# EAGLE design untitled (EAGLE 9.6.2)
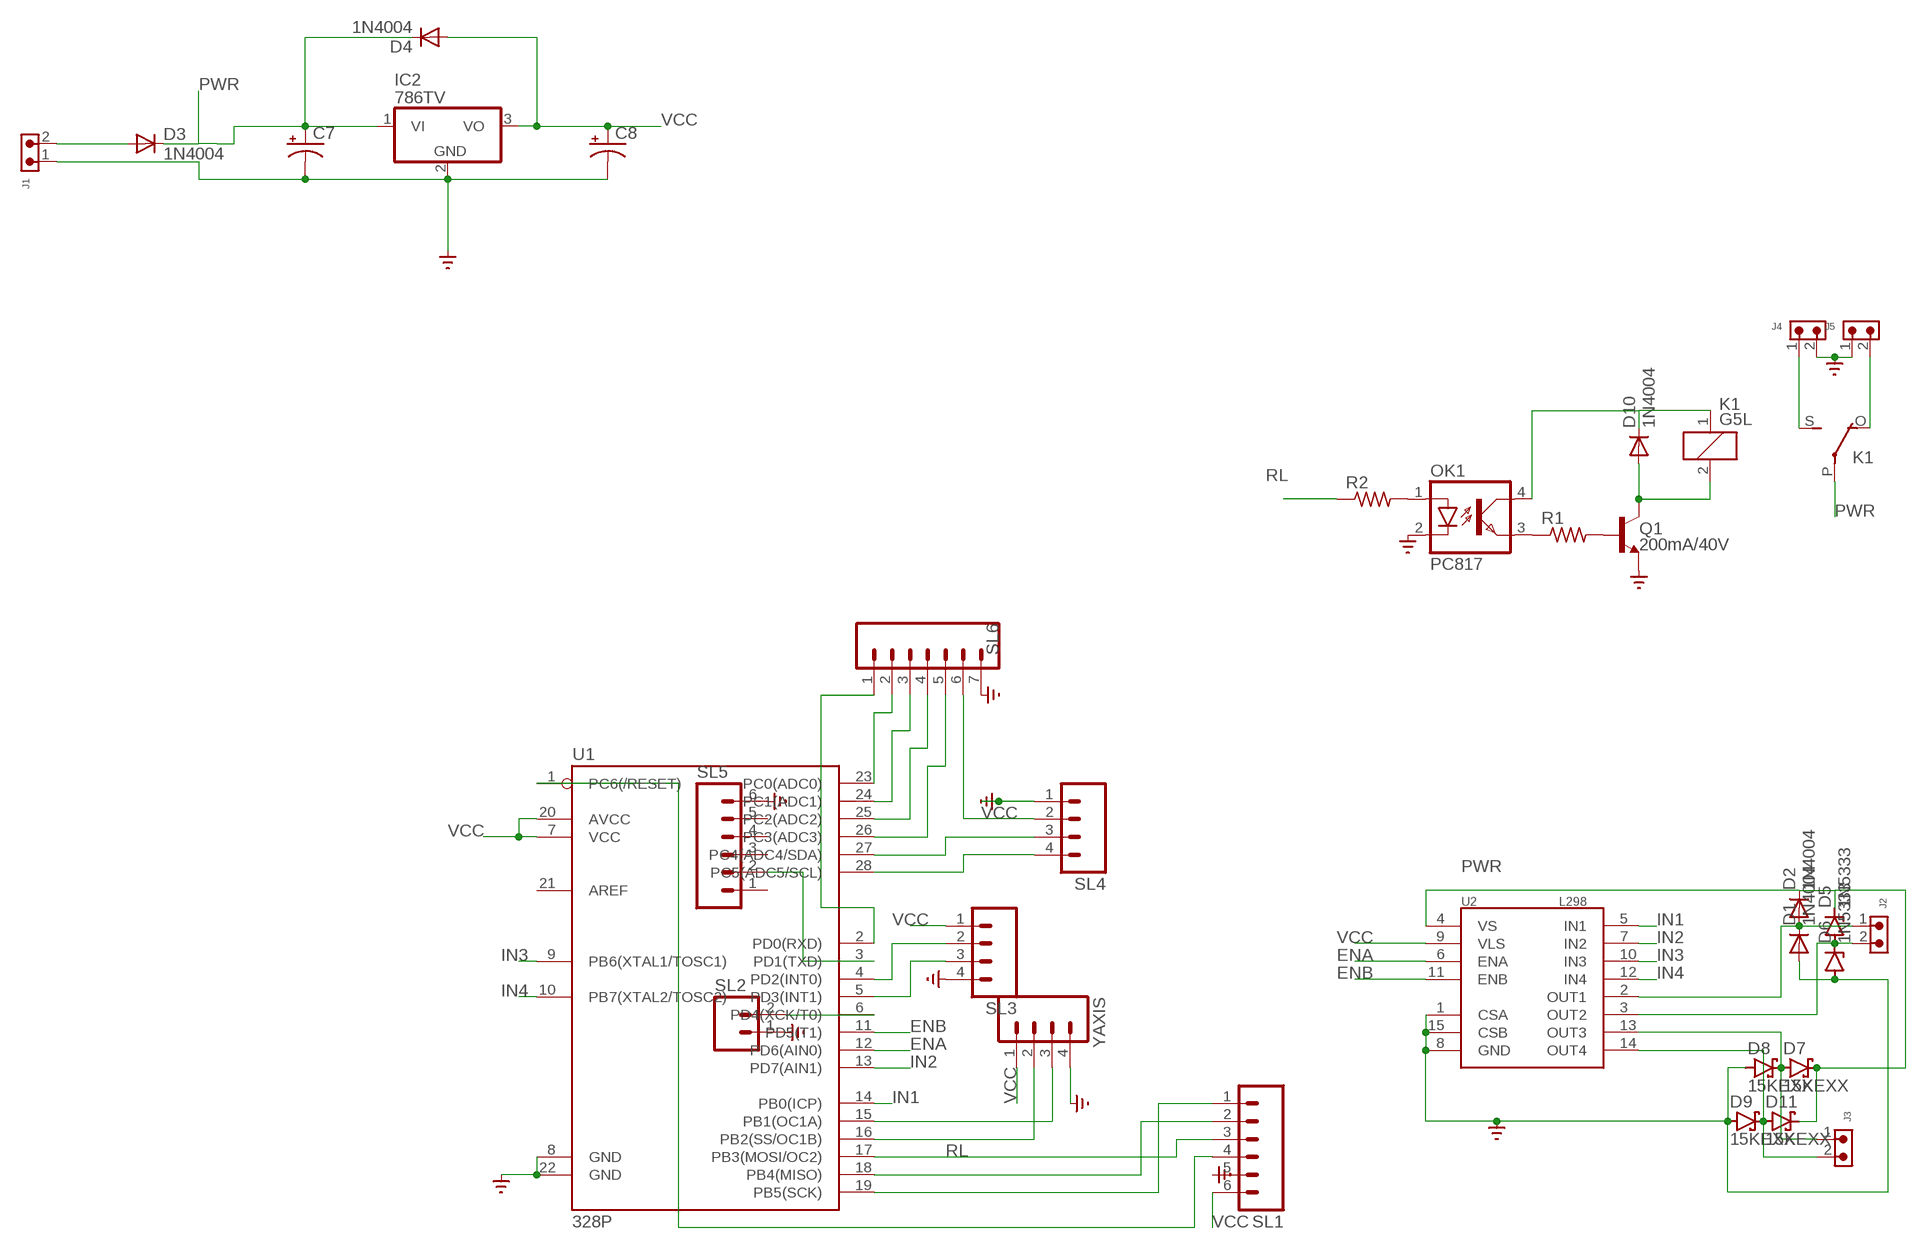
[diagram p0: schematic, sheet 1]

## Parts
C7  CAPACITOR-PE5-10.5  [E5-10,5]
C8  CAPACITOR-PE5-6  [E5-6]
D1  1N4004  [DO41-10]
D2  1N4004  [DO41-10]
D3  1N4004  [DO41-10]
D4  1N4004  [DO41-10]
D5  1N5333  [C1702-15]
D6  1N5333  [C1702-15]
D7  15KEXX  [CB429-17]
D8  15KEXX  [CB429-17]
D9  15KEXX  [CB429-17]
D10  1N4004  [DO41-10]
D11  15KEXX  [CB429-17]
IC2  786TV  [TO220V]
J1  691305530002  [691305530002]
J2  691305530002  [691305530002]
J3  691305530002  [691305530002]
J4  691305530002  [691305530002]
J5  691305530002  [691305530002]
K1  G5L  [G5LE]
OK1  PC817  [DIL04]
Q1  200mA/40V  TRANS_NPN-2N3904  [TO-92]
R1  R-US_0207/10  [0207/10]
R2  R-US_0207/10  [0207/10]
SL1  M06  [06P]
SL2  M02  [02P]
SL3  M04  [04P]
SL4  M04  [04P]
SL5  M06  [06P]
SL6  M07  [07P]
U1  328P  ATMEGA328P_PDIP  [DIP28]
U2  L298  [MULTIWATT15]
YAXIS  M04  [04P]

## Nets
ENA: U1.12(PD6(AIN0)) U2.6(ENA)
ENB: U1.11(PD5(T1)) U2.11(ENB)
GND: C7.- C8.- D1.A D6.A D8.A D9.A IC2.2(GND) J1.1 J4.2 J5.1 OK1.2(C) Q1.1(E) SL1.5 SL2.1 SL3.4 SL4.1 SL5.6 SL6.7 U1.8(GND) U1.22(GND) U2.1(CSA) U2.8(GND) U2.15(CSB) YAXIS.4 ; supply symbol labelled SUPPLY_BRASTAN_GND_
IN1: U1.14(PB0(ICP)) U2.5(IN1)
IN2: U1.13(PD7(AIN1)) U2.7(IN2)
IN3: U1.9(PB6(XTAL1/TOSC1)) U2.10(IN3)
IN4: U1.10(PB7(XTAL2/TOSC2)) U2.12(IN4)
N$1: SL6.2 U1.23(PC0(ADC0))
N$2: SL3.2 U1.4(PD2(INT0))
N$3: SL1.1 U1.19(PB5(SCK))
N$4: SL1.2 U1.18(PB4(MISO))
N$6: SL1.4 U1.1(PC6(/RESET))
N$7: D1.C D2.A J2.1 U2.2(OUT1)
N$8: D5.A D6.C J2.2 U2.3(OUT2)
N$9: D7.A D8.C J3.1 U2.13(OUT3)
N$10: D9.C D11.A J3.2 U2.14(OUT4)
N$11: U1.16(PB2(SS/OC1B)) YAXIS.2
N$12: U1.15(PB1(OC1A)) YAXIS.3
N$13: SL3.3 U1.5(PD3(INT1))
N$14: SL2.2 U1.6(PD4(XCK/T0))
N$15: SL5.2 U1.3(PD1(TXD))
N$16: SL6.1 U1.2(PD0(RXD))
N$17: SL4.3 U1.27(PC4(ADC4/SDA))
N$18: SL4.4 U1.28(PC5(ADC5/SCL))
N$19: SL6.3 U1.24(PC1(ADC1))
N$20: SL6.4 U1.25(PC2(ADC2))
N$21: SL6.5 U1.26(PC3(ADC3))
N$22: D10.C K1.1 OK1.4(COL)
N$23: J5.2 K1.O(2:O)
N$24: J4.1 K1.S(2:S)
N$25: D10.A K1.2 Q1.3(C)
N$26: Q1.2(B) R1.2
N$27: OK1.3(EMIT) R1.1
N$29: OK1.1(A) R2.2
PWR: C7.+ D2.C D3.A D3.C D4.C D5.C D7.C D11.C IC2.1(VI) J1.2 K1.P(2:P) U2.4(VS)
RL: R2.1 SL1.3 U1.17(PB3(MOSI/OC2))
VCC: C8.+ D4.A IC2.3(VO) SL1.6 SL3.1 SL4.2 SL6.6 U1.7(VCC) U1.20(AVCC) U2.9(VLS) YAXIS.1
Unconnected: SL5.1 SL5.3 SL5.4 SL5.5 U1.21(AREF)

## Library data of the parts
C7 C8 = BeagleBone_Blue_R3:CAPACITOR-P: POLARIZED CAPACITOR, American symbol
D1-D4 D10 = adafruit:1N4004: DIODE General purpose 1N400x type rectifier (With bigger pads) http://www.ladyada.net/library/pcb/eaglelibrary.html
D5 D6 = diode:1N5333: Z DIODE 3.3 V, 5W, 5 percent (Motorola)
D7-D9 D11 = diode:15KEXX: DIODE
IC2 = linear:78*: Positive VOLTAGE REGULATOR Source: http://cache.national.com/ds/LM/LM78L05.pdf http://www.fairchildsemi.com/ds/LM/LM7805.pdf
J1-J5 = Wurth_Connectors_WR-TBL Pluggable Connector:691305530002: WR-TBL Serie 3055 - 5,08 mm - PCB Header Vertical Entry with Plastic Latches KIND PROPERTIES Pitch 5.08 mm MATERIAL PROPERTIES Insulator Material PA66 Insulator Flammability Rating UL94 V-0 Insulator Color Green Terminal Material Copper Alloy Terminal Plating Tin-plated surface GENERAL INFORMATION Operating Temperature -40 up to +105 °C ELECTRICAL PROPERTIES IR UL 16 A Working Voltage [UL] 300 V (AC) Withstanding Voltage [UL] 2500 V (AC) Contact Resistance [UL] 20 mΩ CERTIFICATION UL Approval E315414 <https://www.we-online.com/catalog/media/o135349v209%20Family_WR-TBL3_6913055300xx.jpg> Details see: https://www.we-online.com/catalog/en/TBL_5_08_3055_6913055300XX/ Updated by Ella Wu 2019-12-30 2019(C) Wurth Elektronik; DATASHEET-URL: https://www.we-online.com/catalog/datasheet/691305530002.pdf; IR-UL: 16A; MOUNT: THT; PART-NUMBER: 691305530002; PINS: 2; PITCH: 5.08mm; TYPE: Vertical; WORKING-VOLTAGE-UL: 300V (AC)
K1 = relay:G5L: RELAY 1 x switch, 10 A/120 V AC, 8 A/30 V ADC, Omron; OC_FARNELL: unknown; OC_NEWARK: unknown
OK1 = optocoupler:PC817: SHARP OPTO COUPLER; MPN: PC817X4J000F; OC_FARNELL: 9707727; OC_NEWARK: 97K7059
Q1 = SparkFun-DiscreteSemi:TRANS_NPN: NPN transistor Current controlled devices typically used to amplify current or used as a switch. BC547 - COM-08928 <http://www.sparkfun.com/products/8928> (TO-92 45V 100mA) (1.Collector 2.Base 3.Emitter) 2N3904 - COM-00521 <http://www.sparkfun.com/products/521> (TO-92 40V 200mA) (1.Emitter 2.Base 3.Collector) P2N2222A - COM-12852 <http://www.sparkfun.com/products/12852> (TO-92 40V 600mA) (1.Collector 2.Base 3.Emitter); PROD_ID: TRANS-08447
R1 R2 = BeagleBone_Black_Wireless:R-US_: RESISTOR, American symbol
SL1 SL5 = con-amp-quick:M06: AMP QUICK CONNECTOR; OC_FARNELL: unknown; OC_NEWARK: unknown
SL2 = con-amp-quick:M02: AMP QUICK CONNECTOR; OC_FARNELL: unknown; OC_NEWARK: unknown
SL3 SL4 YAXIS = con-amp-quick:M04: AMP QUICK CONNECTOR; OC_FARNELL: unknown; OC_NEWARK: unknown
SL6 = con-amp-quick:M07: AMP QUICK CONNECTOR; OC_FARNELL: unknown; OC_NEWARK: unknown
U1 = SparkFun-IC-Microcontroller:ATMEGA328P_PDIP: Atmel 328P Through hole ATMEGA328P uC used in the Arduino 32kb flash, 1k EEPROM, 2k SRAM Datasheet <http://www.sparkfun.com/datasheets/Components/SMD/ATMega328.pdf> SparkFun Products Storefront component: AVR 28 Pin 20MHz 32K 6A/D - ATMega328P <https://www.sparkfun.com/products/9061> (COM-09061) SparkFun Simon Says - Through-Hole Soldering Kit <https://www.sparkfun.com/products/10547> (KIT-10547) SparkFun Learn to Solder - Simon Says <https://www.sparkfun.com/products/13708> (KIT-13708) SparkFun BigTime Watch Kit <https://www.sparkfun.com/products/11734> (KIT-11734) SparkFun ClockIt <https://www.sparkfun.com/products/10930> (KIT-10930) SparkFun Serial Enabled LCD Kit <https://www.sparkfun.com/products/10097> (LCD-10097) SparkFun Simon Tilts - Through Hole Soldering Kit <https://www.sparkfun.com/products/12634> (KIT-12634) SparkFun Frequency Counter Kit <https://www.sparkfun.com/products/10140> (KIT-10140) FabFM Radio Kit <https://www.sparkfun.com/products/11043> (KIT-11043) SparkFun Binary Blaster Kit <https://www.sparkfun.com/products/12037> (KIT-12037) SparkFun Metro-Gnome <https://www.sparkfun.com/products/9236> (KIT-09236) ATmega328 with Arduino Optiboot (Uno) <https://www.sparkfun.com/products/10524> (DEV-10524); PROD_ID: IC-09136
U2 = SparkFun-IC-Special-Function:L298: L298 Dual Full Bridge Driver

## Board
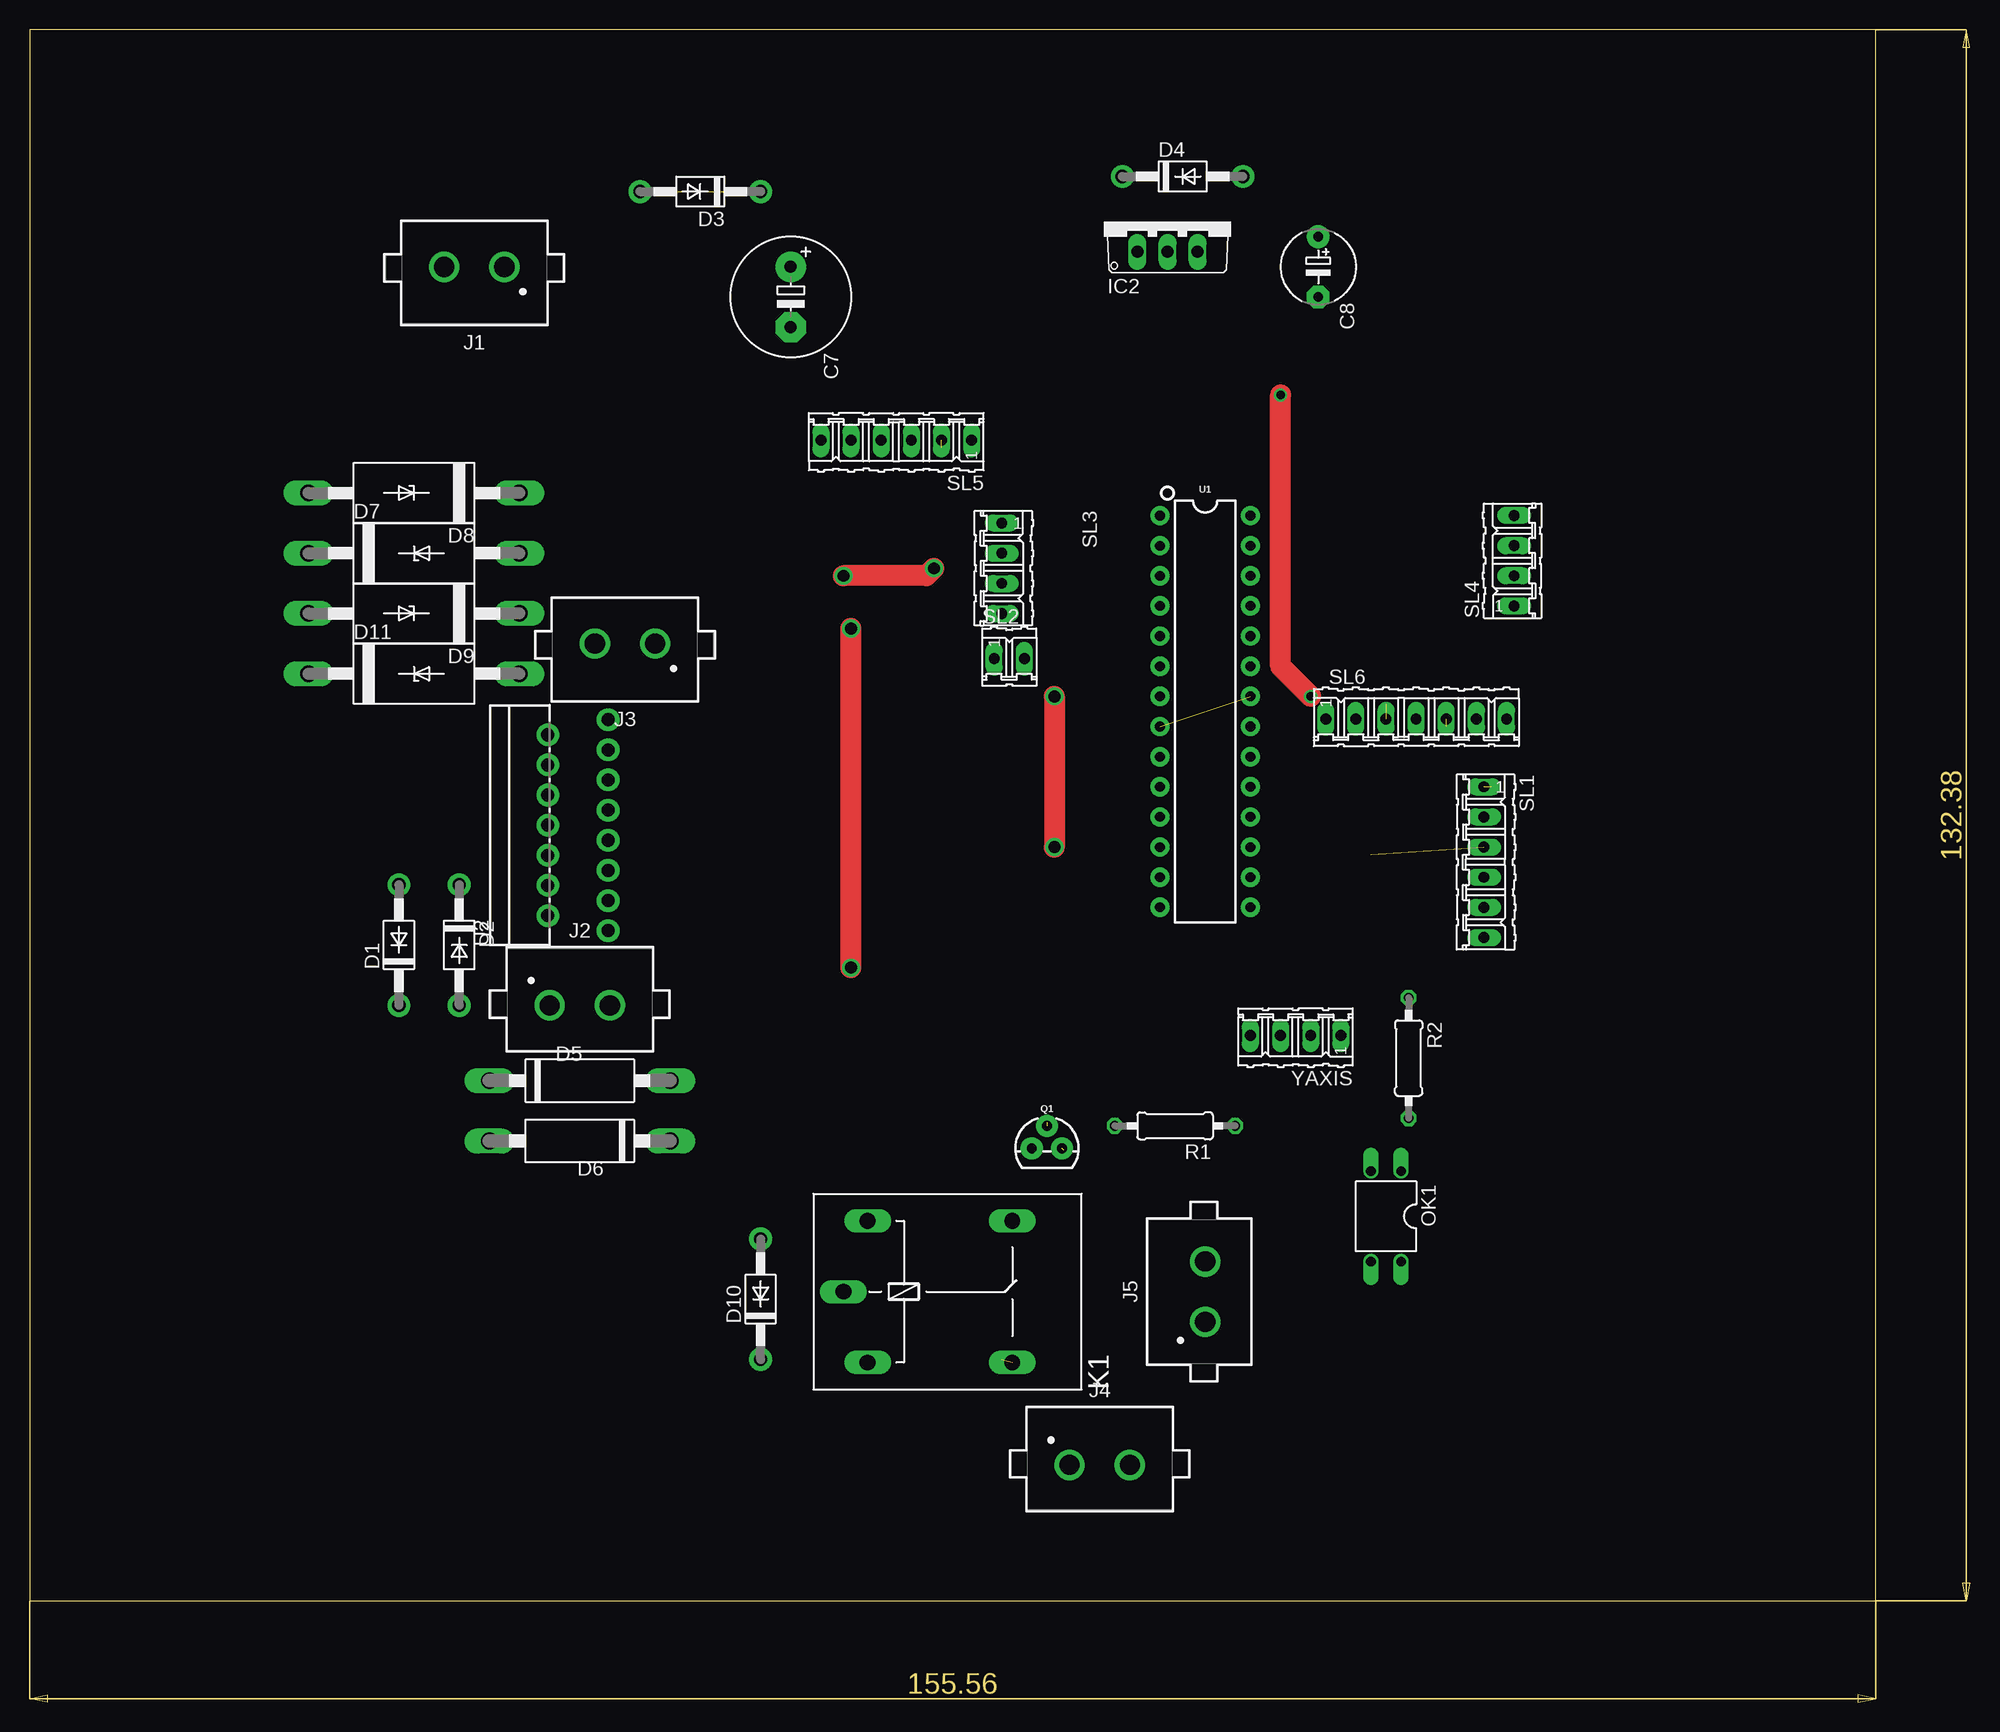
[diagram p1: board, top side]
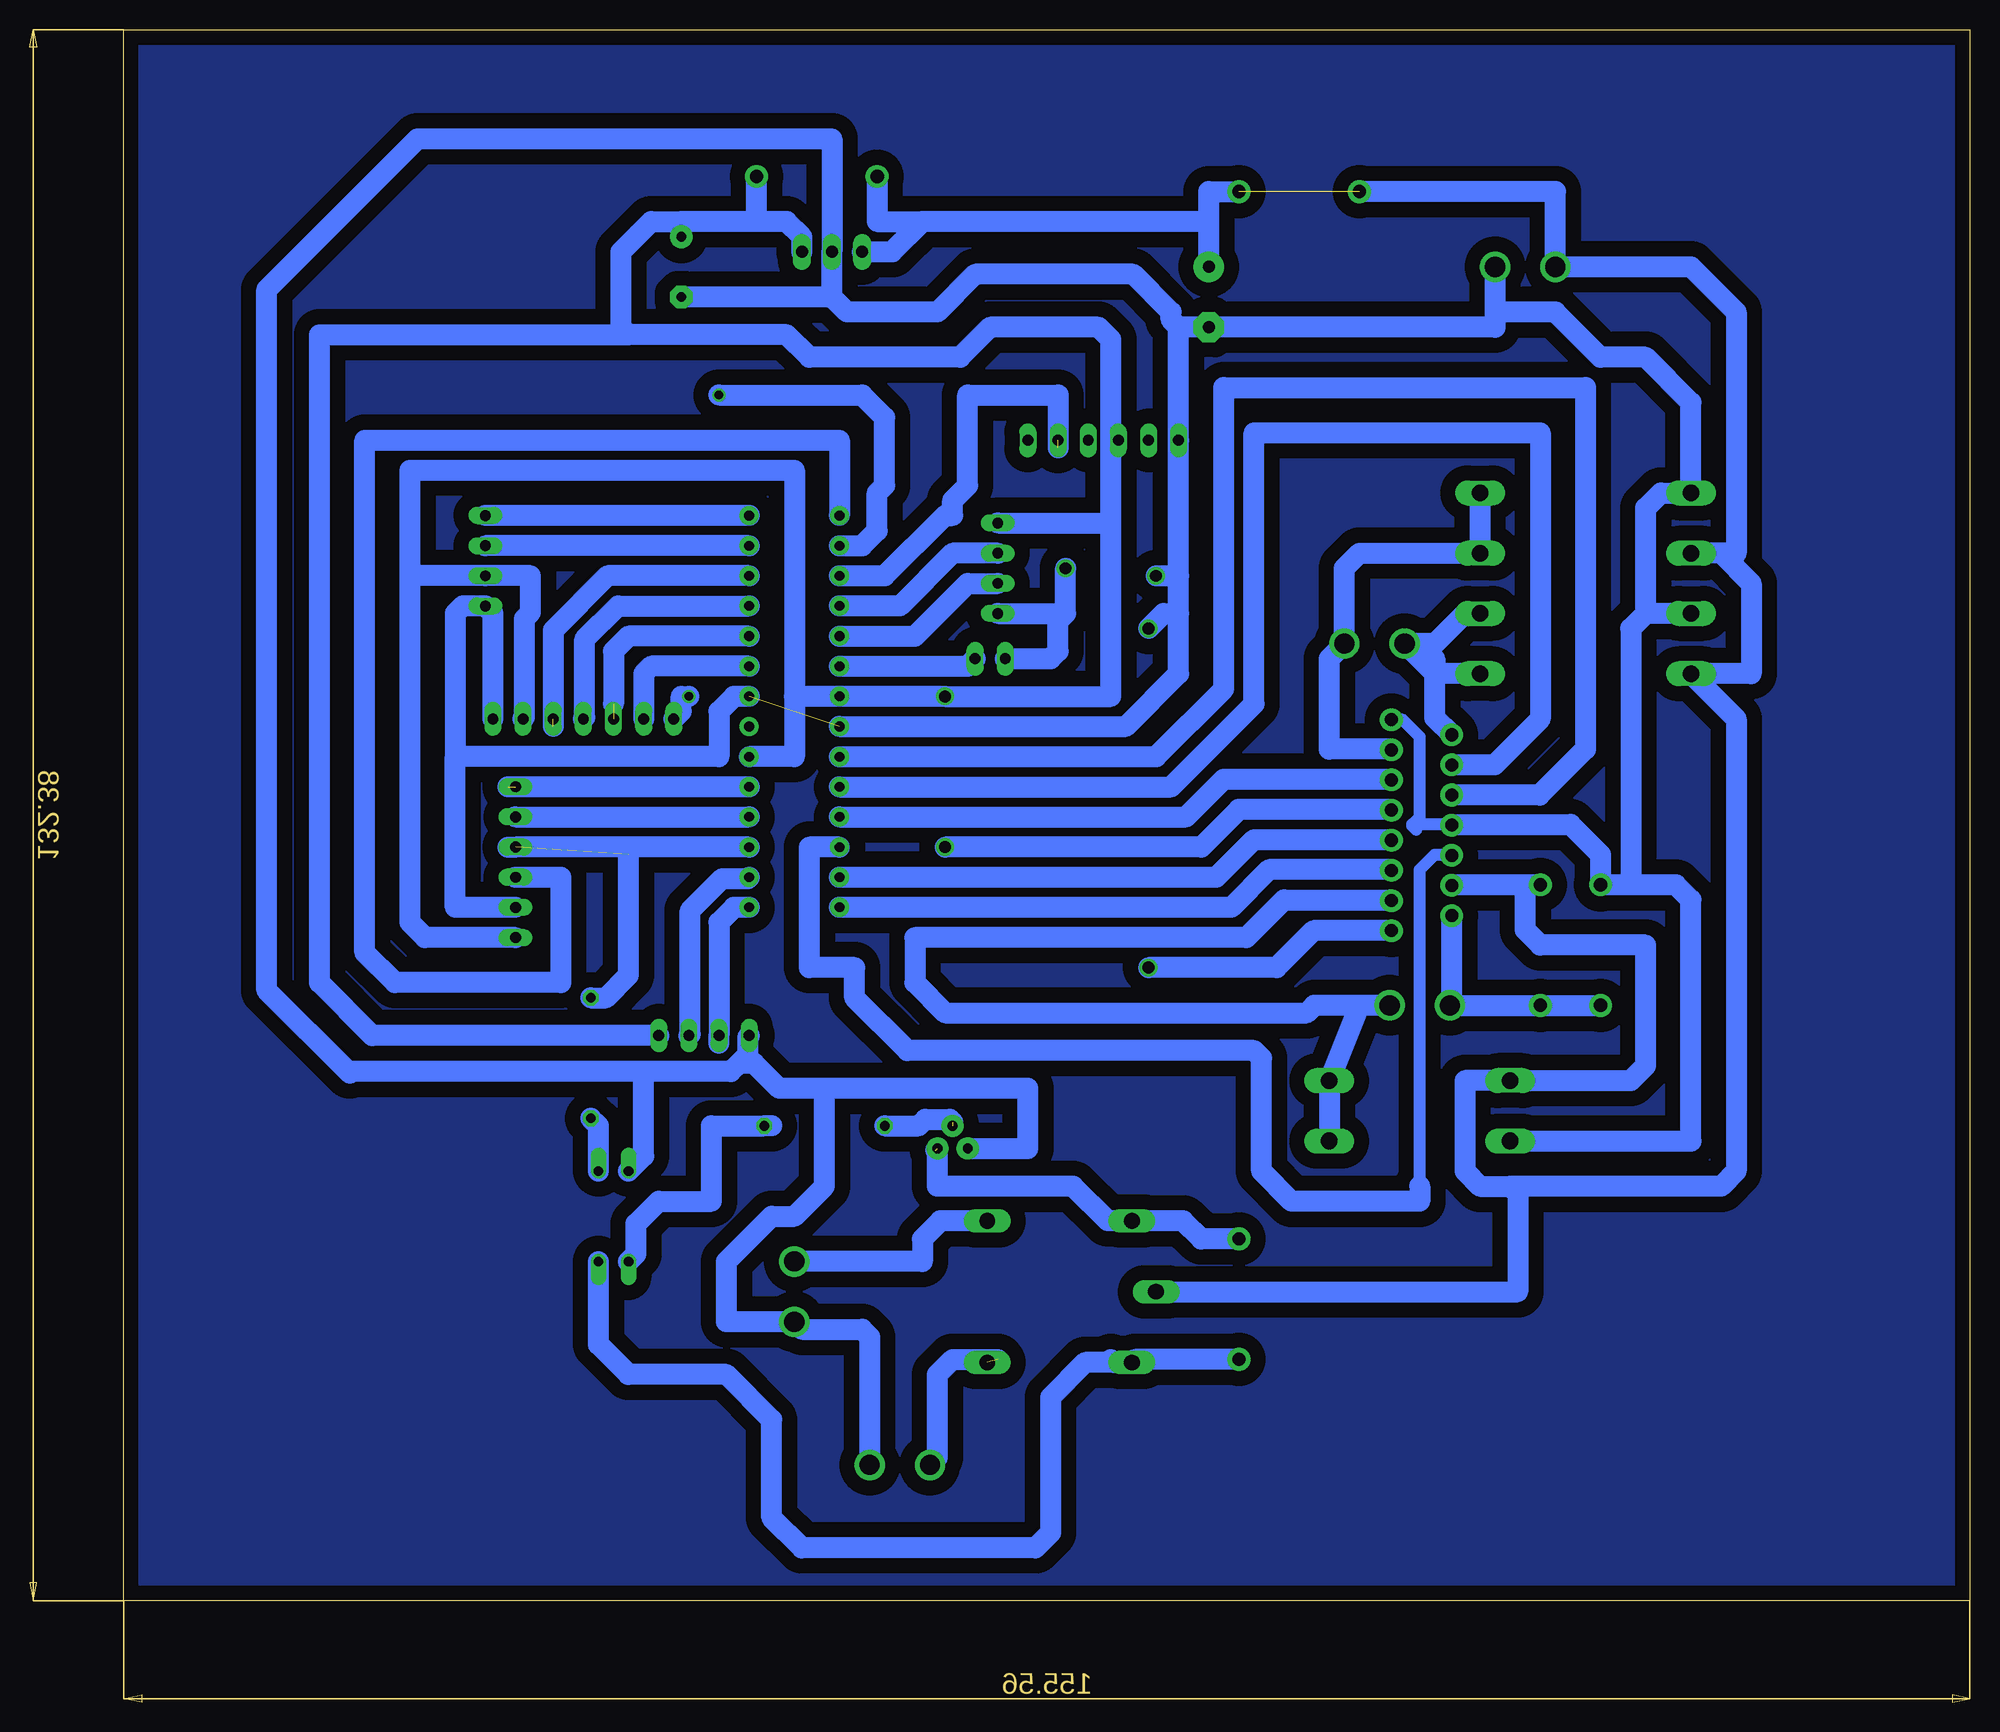
[diagram p2: board, bottom side, seen from below]

Size 155.56 x 132.38 mm. Coordinates in mm from the lower left corner, seen from the top.
Outline: 0,0 155.56,0 155.56,132.38 0,132.38 0,0
Copper layers (1*16): Top 0.035mm / dielectric 1.5mm / Bottom 0.035mm
Design rules "default *": minimum track width 6mil, minimum drill 0.35mm, track to track 25mil, track to pad 25mil, pad to pad 25mil, via to via 25mil, smd to smd 6mil, copper to edge 40mil, drill to drill 6mil, minimum pad ring 10mil, minimum via ring 8mil, stop-mask expansion 4mil, vias tented up to drill 0mil, thermal gap 10mil

### Footprints (pad centres in the part's own frame; a part is rotated, then mirrored left to right if it is on the bottom)
E5-10,5 = drill 1.016 pad 2.54: + -2.54,0 | drill 1.016 pad 2.54 octagon: - 2.54,0
E5-6 = drill 0.813 pad 1.905: + -2.54,0 | drill 0.813 pad 1.905 octagon: - 2.54,0
DO41-10 = drill 1.118 pad 1.93: A 5.08,0; C -5.08,0
C1702-15 = drill 1.397 long: A 7.62,0; C -7.62,0
CB429-17 = drill 1.397 long: A 8.89,0; C -8.89,0
TO220V = drill 1.016 long: 1 -2.54,-2.54; 2 0,-2.54; 3 2.54,-2.54
691305530002 = drill 1.7: 1 -2.54,0; 2 2.54,0
G5LE = drill 1.321 long: 1 -7.493,-5.969; 2 -7.493,5.969; O 4.699,5.969; P -9.525,0; S 4.699,-5.969
DIL04 = drill 0.813 offset: 1 -1.27,-3.81; 2 1.27,-3.81; 3 1.27,3.81; 4 -1.27,3.81
TO-92 = drill 0.813 pad 1.88: 1 -1.27,0; 2 0,1.905; 3 1.27,0
0207/10 = drill 0.813 octagon: 1 -5.08,0; 2 5.08,0
06P = drill 0.914 long: 1 -6.35,0; 2 -3.81,0; 3 -1.27,0; 4 1.27,0; 5 3.81,0; 6 6.35,0
02P = drill 0.914 long: 1 -1.27,0; 2 1.27,0
04P = drill 0.914 long: 1 -3.81,0; 2 -1.27,0; 3 1.27,0; 4 3.81,0
07P = drill 0.914 long: 1 -7.62,0; 2 -5.08,0; 3 -2.54,0; 4 0,0; 5 2.54,0; 6 5.08,0; 7 7.62,0
DIP28 = drill 0.813 pad 1.626: 1 -16.51,-3.81; 2 -13.97,-3.81; 3 -11.43,-3.81; 4 -8.89,-3.81; 5 -6.35,-3.81; 6 -3.81,-3.81; 7 -1.27,-3.81; 8 1.27,-3.81; 9 3.81,-3.81; 10 6.35,-3.81; 11 8.89,-3.81; 12 11.43,-3.81; 13 13.97,-3.81; 14 16.51,-3.81; 15 16.51,3.81; 16 13.97,3.81; 17 11.43,3.81; 18 8.89,3.81; 19 6.35,3.81; 20 3.81,3.81; 21 1.27,3.81; 22 -1.27,3.81; 23 -3.81,3.81; 24 -6.35,3.81; 25 -8.89,3.81; 26 -11.43,3.81; 27 -13.97,3.81; 28 -16.51,3.81
MULTIWATT15 = drill 1.1 pad 1.9: 1 -8.95,-2.39; 2 -7.68,2.69; 3 -6.41,-2.39; 4 -5.14,2.69; 5 -3.87,-2.39; 6 -2.6,2.69; 7 -1.33,-2.39; 8 -0.06,2.69; 9 1.21,-2.39; 10 2.48,2.69; 11 3.75,-2.39; 12 5.02,2.69; 13 6.29,-2.39; 14 7.56,2.69; 15 8.83,-2.39

### Placement (x,y rotation side)
C7  64.14,109.86 270 top
C8  108.58,112.39 270 top
D1  31.11,55.24 90 top
D2  36.2,55.24 270 top
D3  56.52,118.75 180 top
D4  97.16,120.02 0 top
D5  46.35,43.81 0 top
D6  46.35,38.73 180 top
D7  32.38,88.27 0 top
D8  32.38,93.34 180 top
D9  32.38,83.19 180 top
D10  61.59,25.4 90 top
D11  32.38,78.11 0 top
IC2  95.89,116.2 0 top
J1  37.47,112.39 180 top
J2  46.35,50.16 0 top
J3  50.16,80.64 180 top
J4  90.17,11.43 0 top
J5  99.06,26.04 90 top
K1  78.11,26.04 0 top
OK1  114.3,32.38 180 top
Q1  85.72,38.1 0 top
R1  96.52,40.01 180 top
R2  116.2,45.72 270 top
SL1  122.56,62.23 270 top
SL2  82.55,79.38 0 top
SL3  81.92,87 270 top
SL4  125.09,87.63 90 top
SL5  73.03,97.79 180 top
SL6  116.84,74.3 0 top
U1  99.06,74.93 270 top
U2  46.35,65.41 90 top
YAXIS  106.68,47.62 180 top

### Tracks (layer width: path | path; a pad name or v marks a point on that pad's centre or on a via)
ENA
  Bottom 1.016: U2.6 43.73,62.87 45.09,62.87 46.35,61.59 46.35,34.92
  Bottom 1.778: U1.12 97.79,63.5 97.79,53.34 93.98,53.34 93.98,50.8 89.53,46.35 60.33,46.35 59.69,45.72 59.69,36.2 57.15,33.66 46.35,33.66 46.35,34.92
ENB
  Bottom 1.778: U2.11 48.8,69.22 62.87,69.22 66.04,66.04 U1.11
GND  (via drill 1 pad 1.2)  (1 unrouted)
  Top 1.778: v69.22,53.34 v69.22,81.92 | v76.2,87 75.56,86.36 v68.58,86.36
  Bottom 1.016: U2.8 43.73,65.41 46.35,65.41 | 46.35,65.41 46.35,66.04 | 46.35,66.04 46.35,72.78 47.81,74.23 U2.15 | 46.65,64.94 46.99,65.28 46.99,65.41 | 46.99,65.41 46.35,65.41 | 46.35,66.04 46.99,65.41
  Bottom 1.778: SL1.5 127.64,58.42 127.64,71.12 | J1.1 40.01,108.58 | 40.01,108.58 40.01,107.31 C7.- 66.67,107.31 | 95.89,109.86 94.61,108.58 87,108.58 83.82,111.76 70.48,111.76 67.31,108.58 67.31,107.95 66.67,107.31 | 95.89,109.86 IC2.2 95.89,123.19 130.81,123.19 143.51,110.49 143.51,51.44 136.53,44.45 136.4,44.58 111.76,44.58 | 95.89,109.86 C8.- | U1.8 71.12,73.66 66.67,78.11 66.67,83.19 | 66.67,83.19 66.67,86.36 | 66.67,86.36 SL5.6 66.67,107.31 | D6.A 23.5,38.73 23.5,59.05 24.77,60.33 28.57,60.33 | 28.57,60.33 D1.A 31.11,62.87 33.66,65.41 43.6,65.41 U2.8 | 40.01,108.58 34.92,108.58 31.11,104.78 27.3,104.78 23.5,100.97 D8.A 26.04,93.34 27.3,92.08 27.3,83.19 | D9.A 27.3,83.19 | 27.3,83.19 28.57,81.92 28.57,60.33 | U2.1 55.3,56.45 58.42,53.34 v69.22,53.34 | v69.22,81.92 67.94,83.19 66.67,83.19 | 103.7,45.28 103,45.99 103,47.5 YAXIS.4 | 103.7,45.28 104.41,44.58 111.76,44.58 | v68.58,86.36 66.67,86.36 | SL3.4 76.2,83.19 | 76.2,83.19 76.83,82.55 76.83,80.01 77.47,79.38 SL2.1 | 76.2,83.19 v76.2,87 | 127.64,71.12 127.64,83.19 127,83.82 SL4.1 124.46,83.19 SL6.7 | U1.22 104.14,76.2 105.41,74.93 105.41,71.12 127.64,71.12 | OK1.2 111.76,37.47 111.76,44.58 | Q1.1 79.38,38.1 79.38,43.18 96.52,43.18 | 103.7,45.28 102.43,45.28 100.33,43.18 96.52,43.18 | J4.2 92.71,22.23 93.34,22.86 98.42,22.86 J5.1 104.78,23.5 104.78,28.57 100.97,32.38 99.06,32.38 96.52,34.92 96.52,43.18
IN1
  Bottom 1.778: U2.5 48.8,61.59 59.05,61.59 62.23,58.42 U1.14
IN2
  Bottom 1.778: U1.13 63.5,60.96 60.33,64.14 48.8,64.14 U2.7
IN3
  Bottom 1.778: U2.10 36.26,67.89 32.38,71.75 32.38,102.23 62.87,102.23 62.87,76.83 68.58,71.12 U1.9
IN4
  Bottom 1.778: U1.10 67.31,68.58 60.33,75.56 60.33,98.42 36.2,98.42 36.2,74.3 40.06,70.42 U2.12
N$1
  Bottom 1.778: U1.23 111.12,78.74 111.76,78.11 SL6.2
N$2
  Bottom 1.778: U1.4 90.17,83.82 85.72,88.27 SL3.2
N$3  (1 unrouted)
  Bottom 1.778: U1.19 123.19,68.58
N$4
  Bottom 1.778: SL1.2 U1.18
N$5
  pour Bottom (isolate 1.27): 0,132.72 155.57,132.72 155.57,0 0,0
N$6
  Bottom 1.778: U1.1 95.25,97.79 135.25,97.79 135.25,54.61 132.72,52.07 118.75,52.07 118.75,60.96 SL1.4
N$7
  Bottom 1.778: D1.C D2.A J2.1 43.66,50.31 U2.2
N$8
  Bottom 1.778: J2.2 51.44,50.16 | 51.44,50.16 55.24,50.16 55.88,49.53 86.36,49.53 88.9,52.07 88.9,55.88 60.96,55.88 57.78,59.05 48.8,59.05 U2.3 | 51.44,50.16 D5.A D6.C
N$9
  Bottom 1.778: U2.13 48.8,71.75 53.98,71.75 53.98,79.38 J3.1 52.7,87 51.44,88.27 D7.A D8.C
N$10
  Bottom 1.778: U2.14 45.09,74.39 45.09,78.11 | 45.09,78.11 J3.2 45.09,80.64 42.55,83.19 D9.C | 45.09,79.38 45.09,78.11 | D11.A 45.09,78.11
N$11
  Bottom 1.778: YAXIS.2 107.82,47.75 107.82,58.15 105.14,60.83 103,60.83 U1.16
N$12
  Bottom 1.778: U1.15 104.14,58.42 105.41,57.15 YAXIS.3 105.41,46.99
N$13
  Bottom 1.778: U1.5 88.9,81.28 84.45,85.72 SL3.3
N$14
  Bottom 1.778: SL2.2 84.45,78.74 U1.6
N$15  (1 unrouted)
  Bottom 1.778: 76.83,97.16 76.83,101.6 84.45,101.6 84.45,93.98 85.72,92.71 85.72,91.44 86.36,91.44 91.44,86.36 U1.3
N$16  (via drill 0.7)
  Top 1.778: v107.95,76.2 105.41,78.74 v105.41,101.6
  Bottom 1.778: SL6.1 108.58,74.93 108.58,76.2 v107.95,76.2 | v105.41,101.6 93.34,101.6 91.44,99.69 91.44,93.98 92.08,93.34 92.08,90.17 93.34,88.9 U1.2
N$17
  Bottom 1.778: U1.27 SL4.3
N$18
  Bottom 1.778: U1.28 SL4.4
N$19  (1 unrouted)
  Bottom 1.778: 114.3,75.56 114.3,80.01 113.03,81.28 U1.24
N$20
  Bottom 1.778: SL6.4 116.71,74.42 116.71,81.01 113.9,83.82 U1.25
N$21  (1 unrouted)
  Bottom 1.778: 119.38,73.66 119.38,81.75 114.78,86.36 U1.26
N$22
  Bottom 1.778: D10.C 70.36,20.32 K1.1 | K1.1 72.14,20.07 72.39,20.32 | K1.1 74.55,20.07 77.47,17.14 77.47,5.71 78.74,4.45 98.42,4.45 100.97,6.99 100.97,15.24 104.78,19.05 113.03,19.05 115.57,21.59 OK1.4
N$23
  Bottom 1.778: K1.O 86.74,32 88.27,30.48 88.27,28.57 J5.2
N$24  (1 unrouted)
  Bottom 1.778: J4.1 87,12.06 87,19.05 85.72,20.32 81.92,20.32
N$25  (1 unrouted)
  Bottom 1.778: 87.15,37.95 87,37.79 87,34.92 75.56,34.92 72.64,32 K1.2 66.29,32 64.77,30.48 D10.A
N$26  (1 unrouted)
  Bottom 1.778: R1.2 88.57,40.01 88.02,40.56 85.97,40.56 85.72,40.31
N$27
  Bottom 1.778: 100.97,40.01 R1.1 106.05,40.01 106.05,33.66 110.49,33.66 112.39,31.75 112.39,29.21 OK1.3
N$29
  Bottom 1.778: R2.2 115.57,40.01 OK1.1
PWR  (1 unrouted)
  Bottom 1.778: D3.A 34.92,118.75 J1.2 23.5,112.39 19.68,108.58 19.68,88.27 20.95,88.27 | D2.C 37.47,60.33 | 37.47,60.33 43.6,60.33 U2.4 | 37.47,60.33 37.47,56.52 36.2,55.24 27.3,55.24 27.3,45.09 28.57,43.81 D5.C 42.55,43.81 42.55,36.2 41.27,34.92 38.73,34.92 | 38.73,34.92 20.95,34.92 19.68,36.2 19.68,74.3 D11.C 18.41,78.11 18.41,85.72 20.95,88.27 | 20.95,88.27 D7.C | D3.C 64.14,118.75 64.14,116.2 | IC2.1 90.81,113.67 88.27,116.2 | 88.27,116.2 92.08,116.2 D4.C | C7.+ 64.14,116.2 | 64.14,116.2 88.27,116.2 | K1.P 38.1,26.04 38.1,34.29 38.73,34.92
RL  (1 unrouted)
  Bottom 1.778: U1.17 SL1.3 123.19,63.5 | R2.1 114.94,50.8 113.03,52.7 113.03,62.87
VCC  (via drill 1 pad 1.2)
  Top 1.778: v86.36,76.2 v86.36,63.5
  Bottom 1.778: SL1.6 130.18,55.88 131.44,57.15 131.44,86.36 | 131.44,86.36 131.44,95.25 99.06,95.25 99.06,76.2 | 99.06,76.2 99.06,71.12 U1.20 | 99.06,76.2 U1.7 v86.36,76.2 72.39,76.2 72.39,90.81 | U2.9 48.8,66.67 61.59,66.67 64.77,63.5 v86.36,63.5 | IC2.3 98.42,114.94 99.69,116.2 102.23,116.2 | 102.23,116.2 D4.A | 102.23,116.2 108.58,116.2 | 108.58,116.2 C8.+ | 113.03,106.68 113.67,107.31 113.67,113.67 111.12,116.2 108.58,116.2 | 72.39,90.81 72.39,106.28 73.42,107.31 82.55,107.31 85.09,104.78 97.79,104.78 99.69,106.68 113.03,106.68 | YAXIS.1 134.62,47.62 139.06,52.07 139.06,106.68 113.03,106.68 | SL3.1 72.39,90.81 | 131.44,86.36 SL4.2 121.28,86.36 121.28,83.26 121.79,82.75 121.79,74.42 SL6.6